# Altium schematic sheet TransmitterV1.SchDoc
size B
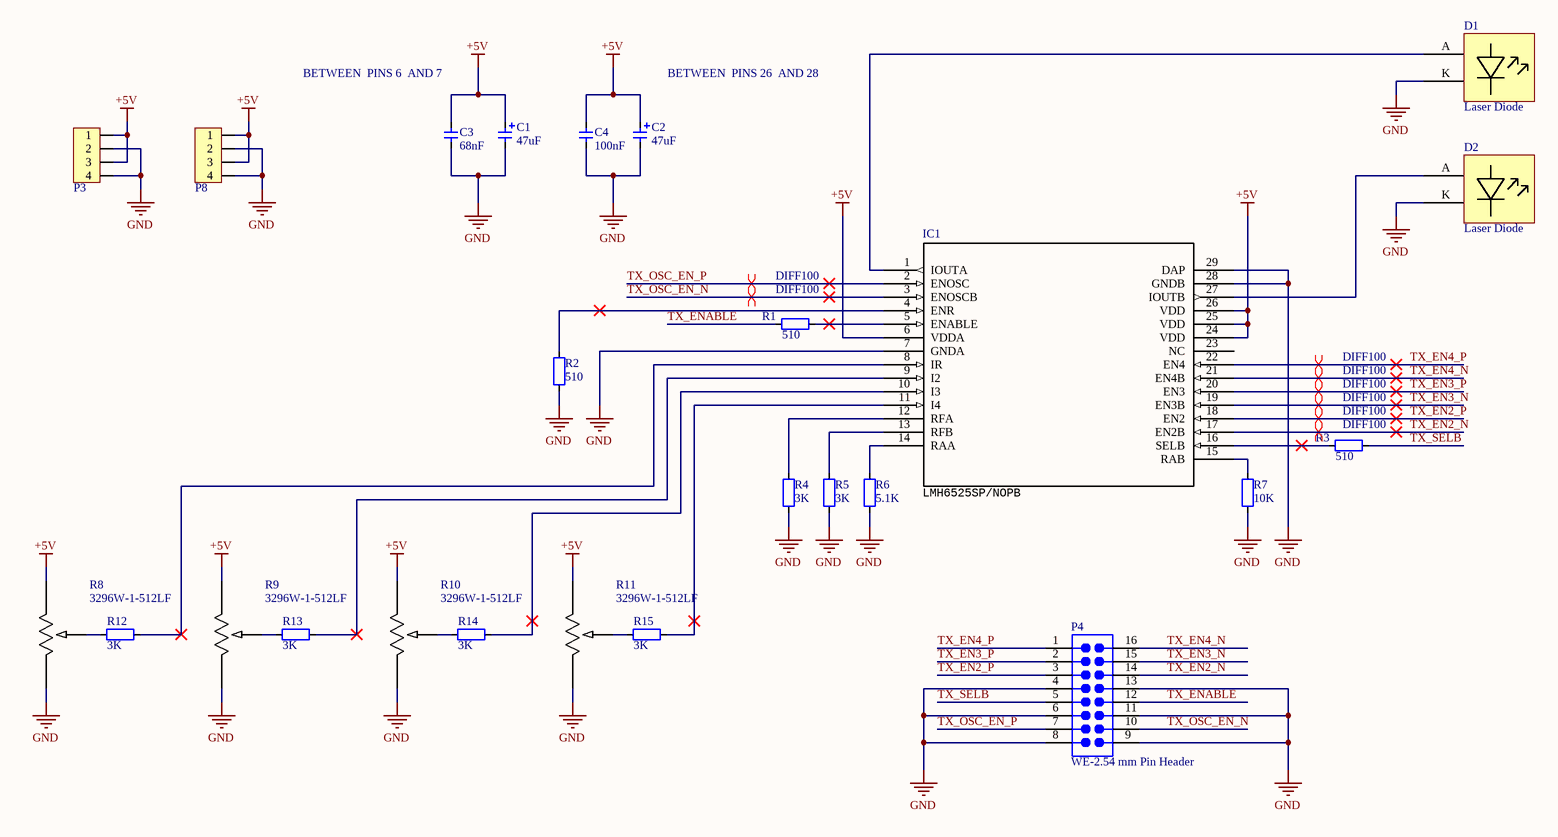
[diagram p0: TransmitterV1.SchDoc]

## Parts
C1  value 47uF  [CAP_TAN_B1210]  (hidden comment: Cap_Tan_1210)
C2  value 47uF  [CAP_TAN_B1210]  (hidden comment: Cap_Tan_1210)
C3  value 68nF  [CAP_0603]  (hidden comment: Cap_0603)
C4  value 100nF  [CAP_0603]  (hidden comment: Cap_0603)
D1  Laser Diode  [LaserDiode]
D2  Laser Diode  [LaserDiode]
IC1  Manufacturer_Part_Number: LMH6525SP/NOPB  [SPA28A]  (hidden comment: LMH6525SPNOPB)
P3  HDR1x4_2.54  [HDR1x4_2.54_180]  (value not drawn)
P4  WE-2.54 mm Pin Header  [61301621121]
P8  HDR1x4_2.54  [HDR1x4_2.54_180]  (value not drawn)
R1  value 510  [RES_0603]  (hidden comment: Res_0603)
R2  value 510  [RES_0603]  (hidden comment: Res_0603)
R3  value 510  [RES_0603]  (hidden comment: Res_0603)
R4  value 3K  [RES_0603]  (hidden comment: Res_0603)
R5  value 3K  [RES_0603]  (hidden comment: Res_0603)
R6  value 5.1K  [RES_0603]  (hidden comment: Res_0603)
R7  value 10K  [RES_0603]  (hidden comment: Res_0603)
R8  3296W-1-512LF  [POT_3296W]
R9  3296W-1-512LF  [POT_3296W]
R10  3296W-1-512LF  [POT_3296W]
R11  3296W-1-512LF  [POT_3296W]
R12  value 3K  [RES_0603]  (hidden comment: Res_0603)
R13  value 3K  [RES_0603]  (hidden comment: Res_0603)
R14  value 3K  [RES_0603]  (hidden comment: Res_0603)
R15  value 3K  [RES_0603]  (hidden comment: Res_0603)

## Nets
+5V: C1.1 C2.1 C3.2 C4.2 IC1.6(VDDA) IC1.24(VDD) IC1.25(VDD) IC1.26(VDD) P3.1 P3.3 P8.1 P8.3 R8.3 R9.3 R10.3 R11.3
GND: C1.2 C2.2 C3.1 C4.1 D1.K D2.K IC1.7(GNDA) IC1.28(GNDB) IC1.29(DAP) P3.2 P3.4 P4.4 P4.6 P4.8 P4.9 P4.11 P4.13 P8.2 P8.4 R2.1 R4.1 R5.1 R6.1 R7.1 R8.1 R9.1 R10.1 R11.1
TX_EN2_N: IC1.17(EN2B) P4.14
TX_EN2_P: IC1.18(EN2) P4.3
TX_EN3_N: IC1.19(EN3B) P4.15
TX_EN3_P: IC1.20(EN3) P4.2
TX_EN4_N: IC1.21(EN4B) P4.16
TX_EN4_P: IC1.22(EN4) P4.1
TX_ENABLE: P4.12 R1.1
TX_OSC_EN_N: IC1.3(ENOSCB) P4.10
TX_OSC_EN_P: IC1.2(ENOSC) P4.7
TX_SELB: P4.5 R3.2
NetD1_A: D1.A IC1.1(IOUTA)
NetD2_A: D2.A IC1.27(IOUTB)
NetIC1_4: IC1.4(ENR) R2.2
NetIC1_5: IC1.5(ENABLE) R1.2
NetIC1_8: IC1.8(IR) R12.2
NetIC1_9: IC1.9(I2) R13.2
NetIC1_10: IC1.10(I3) R14.2
NetIC1_11: IC1.11(I4) R15.2
NetIC1_12: IC1.12(RFA) R4.2
NetIC1_13: IC1.13(RFB) R5.2
NetIC1_14: IC1.14(RAA) R6.2
NetIC1_15: IC1.15(RAB) R7.2
NetIC1_16: IC1.16(SELB) R3.1
NetR8_2: R8.2 R12.1
NetR9_2: R9.2 R13.1
NetR10_2: R10.2 R14.1
NetR11_2: R11.2 R15.1

Not connected (* = marked no-connect by the designer): IC1 23(NC)

## Layout directives
differential pair; net class DIFF100: TX_EN2_N, TX_EN2_P, TX_EN3_N, TX_EN3_P, TX_EN4_N, TX_EN4_P, TX_OSC_EN_N, TX_OSC_EN_P

## Notes on the sheet
- (near C3) BETWEEN  PINS 6  AND 7
- BETWEEN  PINS 26  AND 28

## Library data of the parts
C1 C2 = Cap_Tan_1210: Capacitor
C3 C4 = Cap_0603: Capacitor
IC1 = LMH6525SPNOPB: Imported; Vendor: National Semiconductor; 3D_Library_Name: National_9-26-2011; C: Copyright (C) 2015 Accelerated Designs. All rights reserved; Copyright: Copyright (C) 2015 Accelerated Designs. All rights reserved; RefDes: RefDes; Type: DEV; Value: Value
P3 P8 = HDR1x4_2.54T: Header
P4 = WE-2.54 mm Pin Header & Jumper 61301621121: WR-PHD 2.54 mm Dual Pin Header; Manufacturer: WЁ№rth Elektronik eiSos GmbH; ComponentLink1 Description: Manufacturer; ComponentLink2 Description: Datasheet; NoPins: 16; Created Date: 25 March 2013; partNo: 61301621121; ComponentLink1URL: http://www.we-online.com; ComponentLink2URL: http://katalog.we-online.de/em/datasheet/6130xx21121.pdf; Created by: Karrer Zheng
R1-R7 R12-R15 = Res_0603: Resistor
R8-R11 = 3296W-1-503LF: Imported; Vendor: Bourns Electronics; HEADER_SECTION: Passives; HEADER_GROUP: Resistors; R-S_Number: 5219805; Tolerance: 10%; Voltage: Unknown; C: Copyright (C) 2015 Accelerated Designs. All rights reserved; Manufacturer_Part_Number: 3296W-1-503LF; Manufacturer_Name: Bourns Electronics; Mounting: Through Hole; Value: Value; Package/Case: Unknown; Current Rating: Unknown; Copyright: Copyright (C) 2015 Accelerated Designs. All rights reserved; RefDes: RefDes; Type: DEV